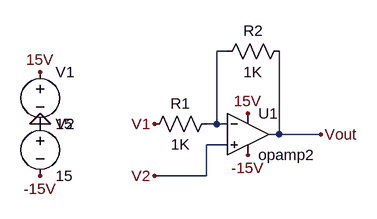
[diagram p0: schematic Draft1.asc]
Draft1.asc, the LTspice schematic file:
Version 4
SHEET 1 880 680
WIRE 224 48 208 48
WIRE 208 160 208 48
WIRE 208 160 192 160
WIRE 224 160 208 160
WIRE 304 176 304 48
WIRE 304 176 288 176
WIRE 368 176 304 176
WIRE 224 192 192 192
WIRE 192 240 192 192
WIRE 192 240 112 240
FLAG -64 160 0
FLAG -64 80 15V
FLAG 256 144 15V
FLAG 256 208 -15V
FLAG -64 240 -15V
FLAG 368 176 Vout
FLAG 112 160 V1
FLAG 112 240 V2
SYMBOL OpAmps\\opamp2 256 112 R0
SYMATTR InstName U1
SYMBOL voltage -64 64 R0
WINDOW 123 0 0 Left 0
WINDOW 39 0 0 Left 0
SYMATTR InstName V1
SYMATTR Value 15
SYMBOL voltage -64 144 R0
WINDOW 123 0 0 Left 0
WINDOW 39 0 0 Left 0
SYMATTR InstName V2
SYMATTR Value 15
SYMBOL res 320 32 R90
WINDOW 0 0 56 VBottom 2
WINDOW 3 32 56 VTop 2
SYMATTR InstName R2
SYMATTR Value 1K
SYMBOL res 208 144 R90
WINDOW 0 0 56 VBottom 2
WINDOW 3 32 56 VTop 2
SYMATTR InstName R1
SYMATTR Value 1K

The netlist it stands for:
* Draft1.asc
XU1 V2 N001 15V -15V Vout opamp2  ; pins In+ In- V+ V- OUT
V1 15V 0 15
V2 0 -15V 15
R2 Vout N001 1K
R1 N001 V1 1K
.backanno
.end